# Altium schematic sheet Power.SchDoc: Power
size Letter; DrawnBy: AdamGilbert; Engineer: AdamGilbert; Revision: Rev0; DocumentName: Power
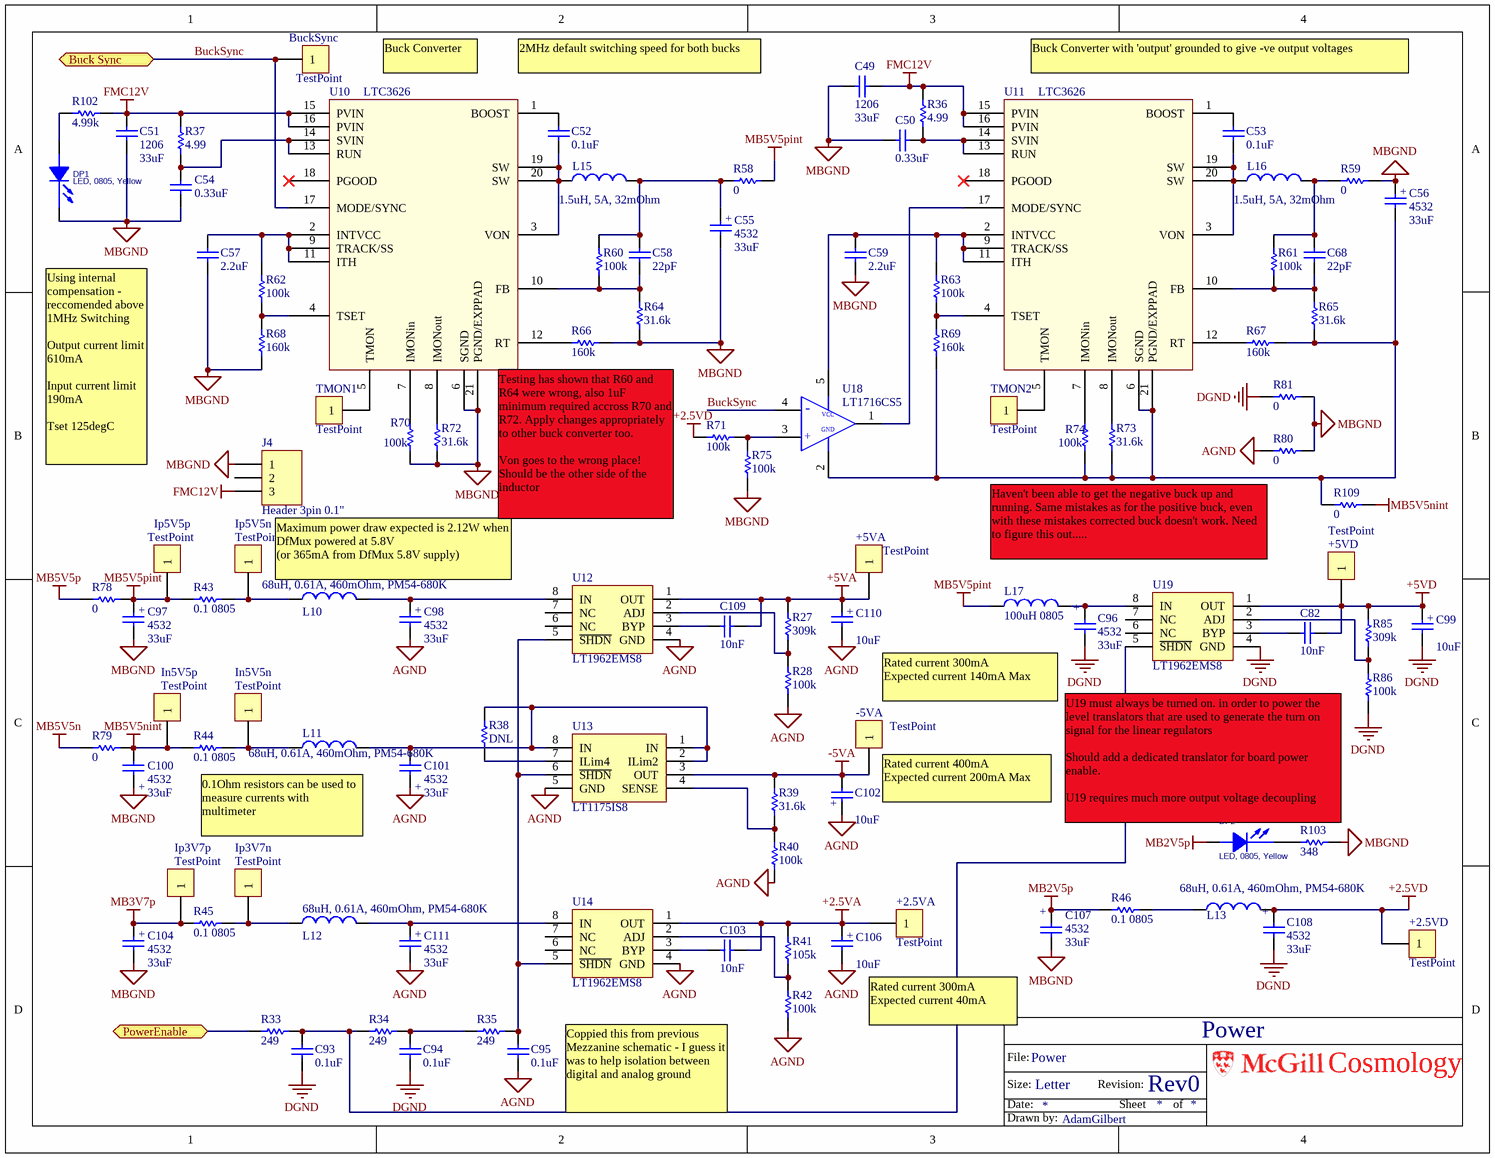
[diagram p0: Power.SchDoc]

## Parts
+2.5VA  TestPoint  [TP-3520-SK]  (no BOM)
+2.5VD  TestPoint  [TP-3520-SK]  (no BOM)
+5VA  TestPoint  [TP-3520-SK]  (no BOM)
+5VD  TestPoint  [TP-3520-SK]  (no BOM)
-5VA  TestPoint  [TP-3520-SK]  (no BOM)
BuckSync  TestPoint  [TP-3520-SK]  (no BOM)
C49  Footprint: 1206  [CC3225-1210]  (hidden comment: 33uF)
C50  0.33uF  [0603]
C51  Footprint: 1206  [CC3225-1210]  (hidden comment: 33uF)
C52  0.1uF  [0603]
C53  0.1uF  [0603]
C54  0.33uF  [0603]
C55  Footprint: 4532  [TANT4532]  (hidden comment: 33uF)
C56  Footprint: 4532  [TANT4532]  (hidden comment: 33uF)
C57  2.2uF  [0603]
C58  22pF  [0603]
C59  2.2uF  [0603]
C68  22pF  [0603]
C82  10nF  [0603]
C93  0.1uF  [0603]
C94  0.1uF  [0603]
C95  0.1uF  [0603]
C96  Footprint: 4532  [TANT4532]  (hidden comment: 33uF)
C97  Footprint: 4532  [TANT4532]  (hidden comment: 33uF)
C98  Footprint: 4532  [TANT4532]  (hidden comment: 33uF)
C99  10uF  [TCASE-A]
C100  Footprint: 4532  [TANT4532]  (hidden comment: 33uF)
C101  Footprint: 4532  [TANT4532]  (hidden comment: 33uF)
C102  10uF  [TCASE-A]
C103  10nF  [0603]
C104  Footprint: 4532  [TANT4532]  (hidden comment: 33uF)
C106  10uF  [TCASE-A]
C107  Footprint: 4532  [TANT4532]  (hidden comment: 33uF)
C108  Footprint: 4532  [TANT4532]  (hidden comment: 33uF)
C109  10nF  [0603]
C110  10uF  [TCASE-A]
C111  Footprint: 4532  [TANT4532]  (hidden comment: 33uF)
DP1  LED, 0805, Yellow  [0805L]
DP2  LED, 0805, Yellow  [0805L]
In5V5n  TestPoint  [TP-3520-SK]  (no BOM)
In5V5p  TestPoint  [TP-3520-SK]  (no BOM)
Ip3V7n  TestPoint  [TP-3520-SK]  (no BOM)
Ip3V7p  TestPoint  [TP-3520-SK]  (no BOM)
Ip5V5n  TestPoint  [TP-3520-SK]  (no BOM)
Ip5V5p  TestPoint  [TP-3520-SK]  (no BOM)
J4  Header 3pin 0.1"  [HDR1X3_MolexVertical]
L10  Part Constraints: 68uH, 0.61A, 460mOhm, PM54-680K  [CHOKEPM54]  (hidden comment: 68uH)
L11  Part Constraints: 68uH, 0.61A, 460mOhm, PM54-680K  [CHOKEPM54]  (hidden comment: 68uH)
L12  Part Constraints: 68uH, 0.61A, 460mOhm, PM54-680K  [CHOKEPM54]  (hidden comment: 68uH)
L13  Part Constraints: 68uH, 0.61A, 460mOhm, PM54-680K  [CHOKEPM54]  (hidden comment: 68uH)
L15  Part Constraints: 1.5uH, 5A, 32mOhm  [IHLP-1212]  (hidden comment: 1.5uH)
L16  Part Constraints: 1.5uH, 5A, 32mOhm  [IHLP-1212]  (hidden comment: 1.5uH)
L17  100uH 0805  [0805]
R27  309k  [0603]
R28  100k  [0603]
R33  249  [0603]
R34  249  [0603]
R35  249  [0603]
R36  4.99  [0603]
R37  4.99  [0603]
R38  DNL  [0603]
R39  31.6k  [0603]
R40  100k  [0603]
R41  105k  [0603]
R42  100k  [0603]
R43  0.1 0805  [0805]
R44  0.1 0805  [0805]
R45  0.1 0805  [0805]
R46  0.1 0805  [0805]
R58  0  [0805]
R59  0  [0805]
R60  100k  [0603]
R61  100k  [0603]
R62  100k  [0603]
R63  100k  [0603]
R64  31.6k  [0603]
R65  31.6k  [0603]
R66  160k  [0603]
R67  160k  [0603]
R68  160k  [0603]
R69  160k  [0603]
R70  100k  [0603]
R71  100k  [0603]
R72  31.6k  [0603]
R73  31.6k  [0603]
R74  100k  [0603]
R75  100k  [0603]
R78  0  [0805]
R79  0  [0805]
R80  0  [1206]
R81  0  [1206]
R85  309k  [0603]
R86  100k  [0603]
R102  4.99k  [0603]
R103  348  [0603]
R109  0  [0805]
TMON1  TestPoint  [TP-3520-SK]  (no BOM)
TMON2  TestPoint  [TP-3520-SK]  (no BOM)
U10  LTC3626  [LTC3626]
U11  LTC3626  [LTC3626]
U12  LT1962EMS8  [MSOP-8]
U13  LT1175IS8  [SO8]
U14  LT1962EMS8  [MSOP-8]
U18  LT1716CS5  [SOT23-5]
U19  LT1962EMS8  [MSOP-8]

## Ports
Buck Sync, PowerEnable

## Nets
+2.5VA: +2.5VA.1 C103.2 C106.1 R41.1 U14.1(OUT)
+2.5VD: +2.5VD.1 C108.1 L13.1 R71.2
+5VA: +5VA.1 C109.2 C110.1 R27.1 U12.1(OUT)
+5VD: +5VD.1 C82.2 C99.1 R85.1 U19.1(OUT)
-5VA: -5VA.1 C102.2 R39.1 U13.3(OUT)
AGND: C95.2 C98.2 C101.1 C102.1 C106.2 C110.2 C111.2 R28.2 R40.2 R42.2 R80.2 U12.4(GND) U13.5(GND) U14.4(GND)
DGND: C93.1 C94.2 C96.2 C99.2 C108.2 R81.2 R86.2 U19.4(GND)
FMC12V: C49.1 C51.1 J4.3 R36.2 R37.1 R102.2 U10.15(PVIN) U10.16(PVIN) U11.15(PVIN) U11.16(PVIN)
MB2V5p: C107.1 DP2.1(ANODE) R46.1
MB3V7p: C104.1 Ip3V7p.1 R45.1
MB5V5n: R79.1
MB5V5nint: C100.2 In5V5p.1 R44.1 R79.2 R109.1
MB5V5p: R78.1
MB5V5pint: C97.1 Ip5V5p.1 L17.1 R43.1 R58.2 R78.2
MBGND: C49.2 C50.1 C51.2 C54.1 C55.2 C56.1 C57.1 C59.1 C97.2 C100.1 C104.2 C107.2 DP1.2(CATHODE) J4.1 R59.2 R64.1 R66.1 R68.2 R70.1 R72.1 R75.2 R80.1 R81.1 R103.1 U10.6(SGND) U10.21(PGND/EXPPAD)
BuckSync: BuckSync.1 U10.17(MODE/SYNC) U18.4(-) ; port Buck Sync
PowerEnable: R33.1 ; port PowerEnable
NetC50_2: C50.2 R36.1 U11.13(RUN) U11.14(SVIN)
NetC52_1: C52.1 L15.1 U10.3(VON) U10.19(SW) U10.20(SW)
NetC52_2: C52.2 U10.1(BOOST)
NetC53_1: C53.1 L16.1 U11.3(VON) U11.19(SW) U11.20(SW)
NetC53_2: C53.2 U11.1(BOOST)
NetC54_2: C54.2 R37.2 U10.13(RUN) U10.14(SVIN)
NetC55_1: C55.1 C58.2 L15.2 R58.1 R60.2
NetC56_2: C56.2 R65.1 R67.1 R69.2 R73.1 R74.1 R109.2 U11.6(SGND) U11.21(PGND/EXPPAD) U18.2(A)
NetC57_2: C57.2 R62.2 U10.2(INTVCC) U10.9(TRACK/SS) U10.11(ITH)
NetC58_1: C58.1 R60.1 R64.2 U10.10(FB)
NetC59_2: C59.2 R63.2 U11.2(INTVCC) U11.9(TRACK/SS) U11.11(ITH) U18.5(Vcc)
NetC68_1: C68.1 R61.1 R65.2 U11.10(FB)
NetC68_2: C68.2 L16.2 R59.1 R61.2
NetC82_1: C82.1 U19.3(BYP)
NetC93_2: C93.2 R33.2 R34.1 U19.5(~{SHDN})
NetC94_1: C94.1 R34.2 R35.1
NetC95_1: C95.1 R35.2 U12.5(~{SHDN}) U13.6(~{SHDN}) U14.5(~{SHDN})
NetC96_1: C96.1 L17.2 U19.8(IN)
NetC98_1: C98.1 L10.2 U12.8(IN)
NetC101_2: C101.2 L11.1 R38.2 U13.1(IN) U13.2(ILim2) U13.8(IN)
NetC103_1: C103.1 U14.3(BYP)
NetC109_1: C109.1 U12.3(BYP)
NetC111_1: C111.1 L12.2 U14.8(IN)
NetDP1_1: DP1.1(ANODE) R102.1
NetDP2_2: DP2.2(CATHODE) R103.2
NetIn5V5n_1: In5V5n.1 L11.2 R44.2
NetIp3V7n_1: Ip3V7n.1 L12.1 R45.2
NetIp5V5n_1: Ip5V5n.1 L10.1 R43.2
NetL13_2: L13.2 R46.2
NetR27_2: R27.2 R28.1 U12.2(ADJ)
NetR38_1: R38.1 U13.7(ILim4)
NetR39_2: R39.2 R40.1 U13.4(SENSE)
NetR41_2: R41.2 R42.1 U14.2(ADJ)
NetR62_1: R62.1 R68.1 U10.4(TSET)
NetR63_1: R63.1 R69.1 U11.4(TSET)
NetR66_2: R66.2 U10.12(RT)
NetR67_2: R67.2 U11.12(RT)
NetR70_2: R70.2 U10.7(IMONin)
NetR71_1: R71.1 R75.1 U18.3(+)
NetR72_2: R72.2 U10.8(IMONout)
NetR73_2: R73.2 U11.8(IMONout)
NetR74_2: R74.2 U11.7(IMONin)
NetR85_2: R85.2 R86.1 U19.2(ADJ)
NetTMON1_1: TMON1.1 U10.5(TMON)
NetTMON2_1: TMON2.1 U11.5(TMON)
NetU11_17: U11.17(MODE/SYNC) U18.1(Out)

Not connected (* = marked no-connect by the designer): J4 2; U10 18(PGOOD)*; U11 18(PGOOD)*; U12 6(NC) 7(NC); U14 6(NC) 7(NC); U19 6(NC) 7(NC)

## Notes on the sheet
- (near U10) Buck Converter
- 2MHz default switching speed for both bucks
- Buck Converter with 'output' grounded to give -ve output voltages
- Using internal compensation - reccomended above 1MHz Switching
  Output current limit 610mA
  Input current limit 190mA
  Tset 125degC
- (near U10) Testing has shown that R60 and R64 were wrong, also 1uF minimum required accross R70 and R72. Apply changes appropriately to other buck converter too.
  Von goes to the wrong place! Should be the other side of the inductor
- Haven't been able to get the negative buck up and running. Same mistakes as for the positive buck, even with these mistakes corrected buck doesn't work. Need to figure this out.....
- Maximum power draw expected is 2.12W when DfMux powered at 5.8V
  (or 365mA from DfMux 5.8V supply)
- Rated current 300mA
  Expected current 140mA Max
- 0.1Ohm resistors can be used to measure currents with multimeter
- (near -5VA) Rated current 400mA
  Expected current 200mA Max
- U19 must always be turned on. in order to power the level translators that are used to generate the turn on signal for the linear regulators
  Should add a dedicated translator for board power enable.
  U19 requires much more output voltage decoupling
- Rated current 300mA
  Expected current 40mA
- Coppied this from previous Mezzanine schematic - I guess it was to help isolation between digital and analog ground
- File:
- Size:
- Date:
- Letter
- Revision:
- Sheet
- of
- Cosmology
- Drawn by:
- (in symbol CAP4532) +
- (in symbol CAP TANT CASE-A) +
- (in symbol LT1716CS5) VCC; GND

## Library data of the parts
+2.5VA +2.5VD +5VA +5VD -5VA BuckSync In5V5n In5V5p Ip3V7n Ip3V7p Ip5V5n Ip5V5p TMON1 TMON2 = TestPoint: TestPoint1; Assembly Comments: none; Footprint: *; Type: Test Point; SupplierUnitCost: 0
C49 C51 = CAP 1210: Capacitor, Ceramic, 1210; Manufacturer: TDK Corporation; Part Constraints: 33uF or 47uF  (1206 or 1210) 25V X5R; Manufacturers Part Number: C3216X5R1E336M; Assembly Comments: none; Type: Capacitor; SupplierUnitCost: $1.1; Value: 33uF; Supplier 1: Digi-Key; Supplier Part Number 1: 445-8046-1-ND
C50 C52-C54 C58 C68 C82 C93-C95 C103 C109 = CAP 0603: Capacitor, Ceramic, 0603; Part Constraints: 10% 16V X7R 0603; Manufacturer: Generic; Assembly Comments: none; Manufacturers Part Number: Generic; Type: Capacitor; SupplierUnitCost: 0
  C50 C54: Value: 0.33uF
  C52 C53 C93-C95: Value: 0.1uF
  C58 C68: Value: 22pF
  C82 C103 C109: Value: 10nF
C55 C56 C96-C98 C100 C101 C104 C107 C108 C111 = CAP4532: 33u, 16V, 20%, 4532C, X5R; Manufacturer: TDK Corporation; Manufacturers Part Number: C4532X5R1C336M; Type: Capacitor; Assembly Comments: none; Part Constraints: 33u, 16V, 20%, 4532C, X5R; SupplierUnitCost: $1.30; Supplier 1: Digi-Key; Supplier Part Number 1: 445-1443-1-ND; Value: 33uF
C57 C59 = CAP 0603: Capacitor, Ceramic, 0603; Part Constraints: 10% 10V X5R 0603; Manufacturer: Generic; Assembly Comments: none; Manufacturers Part Number: Generic; Type: Capacitor; SupplierUnitCost: 0; Value: 2.2uF
C99 C102 C106 C110 = CAP TANT CASE-A: TantA Cap; Manufacturer: Generic; Part Constraints: 16V TantA; Type: Capacitor; Assembly Comments: none; Manufacturers Part Number: Generic; SupplierUnitCost: 0; Value: 10uF
DP1 DP2 = LED, yellow, 0805, 2mA: LED; Part Constraints: 511-1293-1-ND; Manufacturer: Rohm Semiconductor; Manufacturers Part Number: SML-211YTT86; Assembly Comments: none; Supplier 1: Digi-Key; Supplier Part Number 1: 511-1293-1-ND; Type: LED; SupplierUnitCost: $0.64
J4 = Header 3: Header, 0.1"  3-Pin; Manufacturer: Molex; Manufacturers Part Number: 0099990987; Assembly Comments: none; Part Constraints: 0099990987; Type: Header; SupplierUnitCost: $1.00
L10-L13 = INDPM54: Inductor PM54; Manufacturer: Bourns Inc.; Manufacturers Part Number: PM54-680K; Assembly Comments: none; Footprint: PM54; Type: Inductor; SupplierUnitCost: $1.12; Supplier 1: Digi-Key; Supplier Part Number 1: M8524CT-ND; Value: 68uH
L15 L16 = IND IHLP1212: Inductor IHLP1212; Manufacturer: Vishay Dale; Manufacturers Part Number: IHLP1212BZER1R5M11; Assembly Comments: none; Footprint: IHLP1212; Type: Inductor; SupplierUnitCost: $1.30; Value: 1.5uH; Supplier 1: Digi-Key; Supplier Part Number 1: 541-1321-1-ND
L17 = IND 0805: Inductor 0805; Manufacturer: TDK Corporation; Manufacturers Part Number: GLCR2012T101M-HC; Part Constraints: 100uH, 4.5Ohms DRC, Irms 40mA; Assembly Comments: none; Type: Inductor; SupplierUnitCost: $0.33; Value: 100uH 0805
R27 R28 R33-R42 R60-R75 R85 R86 R102 R103 = RES 0603: Resistor; Manufacturer: Generic; Part Constraints: 1% 1/10W 100ppm 0603; Assembly Comments: none; Manufacturers Part Number: Generic; Type: Resistor; SupplierUnitCost: 0
  R27 R85: Value: 309k
  R28 R40 R42 R60-R63 R70 R71 R74 R75 R86: Value: 100k
  R33-R35: Value: 249
  R36 R37: Value: 4.99
  R38: Value: DNL
  R39 R64 R65 R72 R73: Value: 31.6k
  R41: Value: 105k
  R66-R69: Value: 160k
  R102: Value: 4.99k
  R103: Value: 348
R43-R46 = RES 0805: RES 0.1 OHM 1/8W 0805 SMD; Manufacturer: Panasonic Electronic Components; Part constraints: 1% 100ppm 1/8W 0805; Manufacturers Part Number: ERJ-L06KF10CV; Assembly Comments: none; Type: Resistor; SupplierUnitCost: $0.83; Value: 0.1 0805; Supplier 1: Digi-Key; Supplier Part Number 1: P100LLCT-ND
R58 R59 R78 R79 R109 = RES 0805: RES 0.0 OHM 1/8W 0805 SMD; Manufacturer: Generic; Part constraints: 1% 100ppm 1/8W 0805; Assembly Comments: none; Manufacturers Part Number: Generic; Type: Resistor; SupplierUnitCost: 0; Value: 0
R80 R81 = RES 1206: RES 0.0 OHM 1/8W 1206 SMD; Manufacturer: Generic; Part constraints: 1% 100ppm 1/8W 1206; Assembly Comments: none; Manufacturers Part Number: Generic; Type: Resistor; SupplierUnitCost: 0; Value: 0
U10 U11 = LTC3626: 20V, 2.5A Sync buck, 3Mhz; Part Constraints: LTC3626EUDC#PBF; Manufacturer: Linear Technology; Assembly Comments: none; Supplier 1: Digi-Key; Supplier Part Number 1: LTC3626EUDC#PBF-ND; Manufacturers Part Number: LTC3626EUDC#PBF; Type: IC; SupplierUnitCost: $8.10
U12 U14 U19 = LT1962EMS8: REG, micropower, low noise, low  dropout; Manufacturer: Linear Technology; Manufacturers Part Number: LT1962EMS8#PBF; Part Constraints: LT1962EMS8; Supplier 1: Digi-Key; Supplier Part Number 1: LT1962EMS8#PBF-ND
U13 = LT1175IS8: REG, negative micropower low dropout; Manufacturer: Linear Technology; Manufacturers Part Number: LT1175IS8#PBF; Part Constraints: LT1175IS8; Supplier 1: Digi-Key; Supplier Part Number 1: LT1175IS8#PBF-ND
U18 = LT1716CS5: Comparator 2.7V to 44V rail to rail; Manufacturer: Linear Technology; Part Constraints: LT1716CS5#TRMPBF; Assembly Comments: none; Manufacturers Part Number: LT1716CS5#TRMPBF; SupplierUnitCost: $2.75; Type: IC; Supplier 1: Digi-Key; Supplier Part Number 1: LT1716CS5#TRMPBFCT-ND